# EAGLE design Slave-Nano (EAGLE 9.6.2)
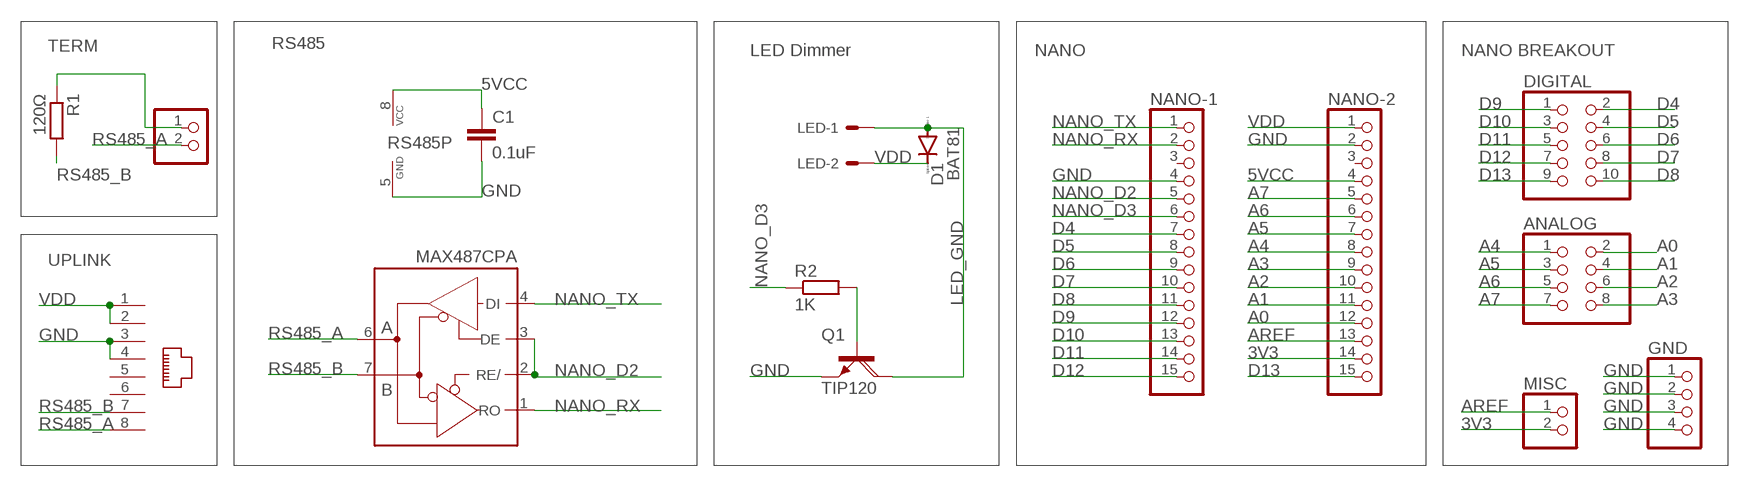
[diagram p0: schematic, sheet 1]

## Parts
ANALOG  PINHD-2X4  [2X04]
C1  0.1uF  C-EU025-025X050  [C025-025X050]
D1  BAT81  [DO34-7]
DIGITAL  PINHD-2X5  [2X05]
GND  PINHD-1X4  [1X04]
LED  KK-156-2  [KK-156-2]
MISC  PINHD-1X2  [1X02]
NANO-1  PINHD-1X15  [1X15]
NANO-2  PINHD-1X15  [1X15]
Q1  TIP120  [TO220AH]
R1  120Ω  R-EU_0204/7  [0204/7]
R2  1K  R-EU_0204/7  [0204/7]
RS485  MAX487CPA  [DIL08]
TERM  PINHD-1X2  [1X02]
UPLINK  RJ45-8P8C  [RJ45-8P8C]

## Nets
3V3: MISC.2 NANO-2.14
5VCC: C1.1 NANO-2.4 RS485.8(VCC)
A0: ANALOG.2 NANO-2.12
A1: ANALOG.4 NANO-2.11
A2: ANALOG.6 NANO-2.10
A3: ANALOG.8 NANO-2.9
A4: ANALOG.1 NANO-2.8
A5: ANALOG.3 NANO-2.7
A6: ANALOG.5 NANO-2.6
A7: ANALOG.7 NANO-2.5
AREF: MISC.1 NANO-2.13
D4: DIGITAL.2 NANO-1.7
D5: DIGITAL.4 NANO-1.8
D6: DIGITAL.6 NANO-1.9
D7: DIGITAL.8 NANO-1.10
D8: DIGITAL.10 NANO-1.11
D9: DIGITAL.1 NANO-1.12
D10: DIGITAL.3 NANO-1.13
D11: DIGITAL.5 NANO-1.14
D12: DIGITAL.7 NANO-1.15
D13: DIGITAL.9 NANO-2.15
GND: C1.2 GND.1 GND.2 GND.3 GND.4 NANO-1.4 NANO-2.2 Q1.E RS485.5(GND) UPLINK.3 UPLINK.4
LED_GND: D1.A LED.1 Q1.C
LED_PWM: Q1.B R2.2
NANO_D2: NANO-1.5 RS485.2(RE/) RS485.3(DE)
NANO_D3: NANO-1.6 R2.1
NANO_RX: NANO-1.2 RS485.1(RO)
NANO_TX: NANO-1.1 RS485.4(DI)
RS485_A: RS485.6(A) TERM.2 UPLINK.8
RS485_B: R1.2 RS485.7(B) UPLINK.7
TERM: R1.1 TERM.1
VDD: D1.C LED.2 NANO-2.1 UPLINK.1 UPLINK.2
Unconnected: NANO-1.3 NANO-2.3 UPLINK.5 UPLINK.6

## Notes on the sheet
- LED Dimmer | NANO | NANO BREAKOUT

## Library data of the parts
ANALOG = pinhead:PINHD-2X4: PIN HEADER
C1 = rcl:C-EU: CAPACITOR, European symbol; SPICEPREFIX: C
D1 = diode:BAT81: DIODE barrier diode
DIGITAL = pinhead:PINHD-2X5: PIN HEADER
GND = pinhead:PINHD-1X4: PIN HEADER
LED = con-molex:KK-156-2: KK 156 HEADER Source: http://www.molex.com/pdm_docs/sd/026604100_sd.pdf; MF: MOLEX; OC_FARNELL: unknown; OC_NEWARK: unknown
MISC TERM = pinhead:PINHD-1X2: PIN HEADER
NANO-1 NANO-2 = pinhead:PINHD-1X15: PIN HEADER
Q1 = transistor-power:TIP120: NPN DARLINGTON TRANSISTOR
R1 R2 = rcl:R-EU_: RESISTOR, European symbol; SPICEPREFIX: R
RS485 = A10 Library:MAX487CPA: RS485 TRANSEIVER; MPN: MAX487CPA; OC_FARNELL: unknown; OC_NEWARK: unknown
UPLINK = A10 Library:RJ45-8P8C: PCB RJ45 8P8C Femlae Jack/Socket Connector 180 degree vertical https://www.aliexpress.com/item/32918645271.html?spm=a2g0o.order_list.0.0.49471802RMJK7Q

## Net classes
0 default: width 0.406 mm, drill 0.254 mm, clearance 0.406 mm

## Board
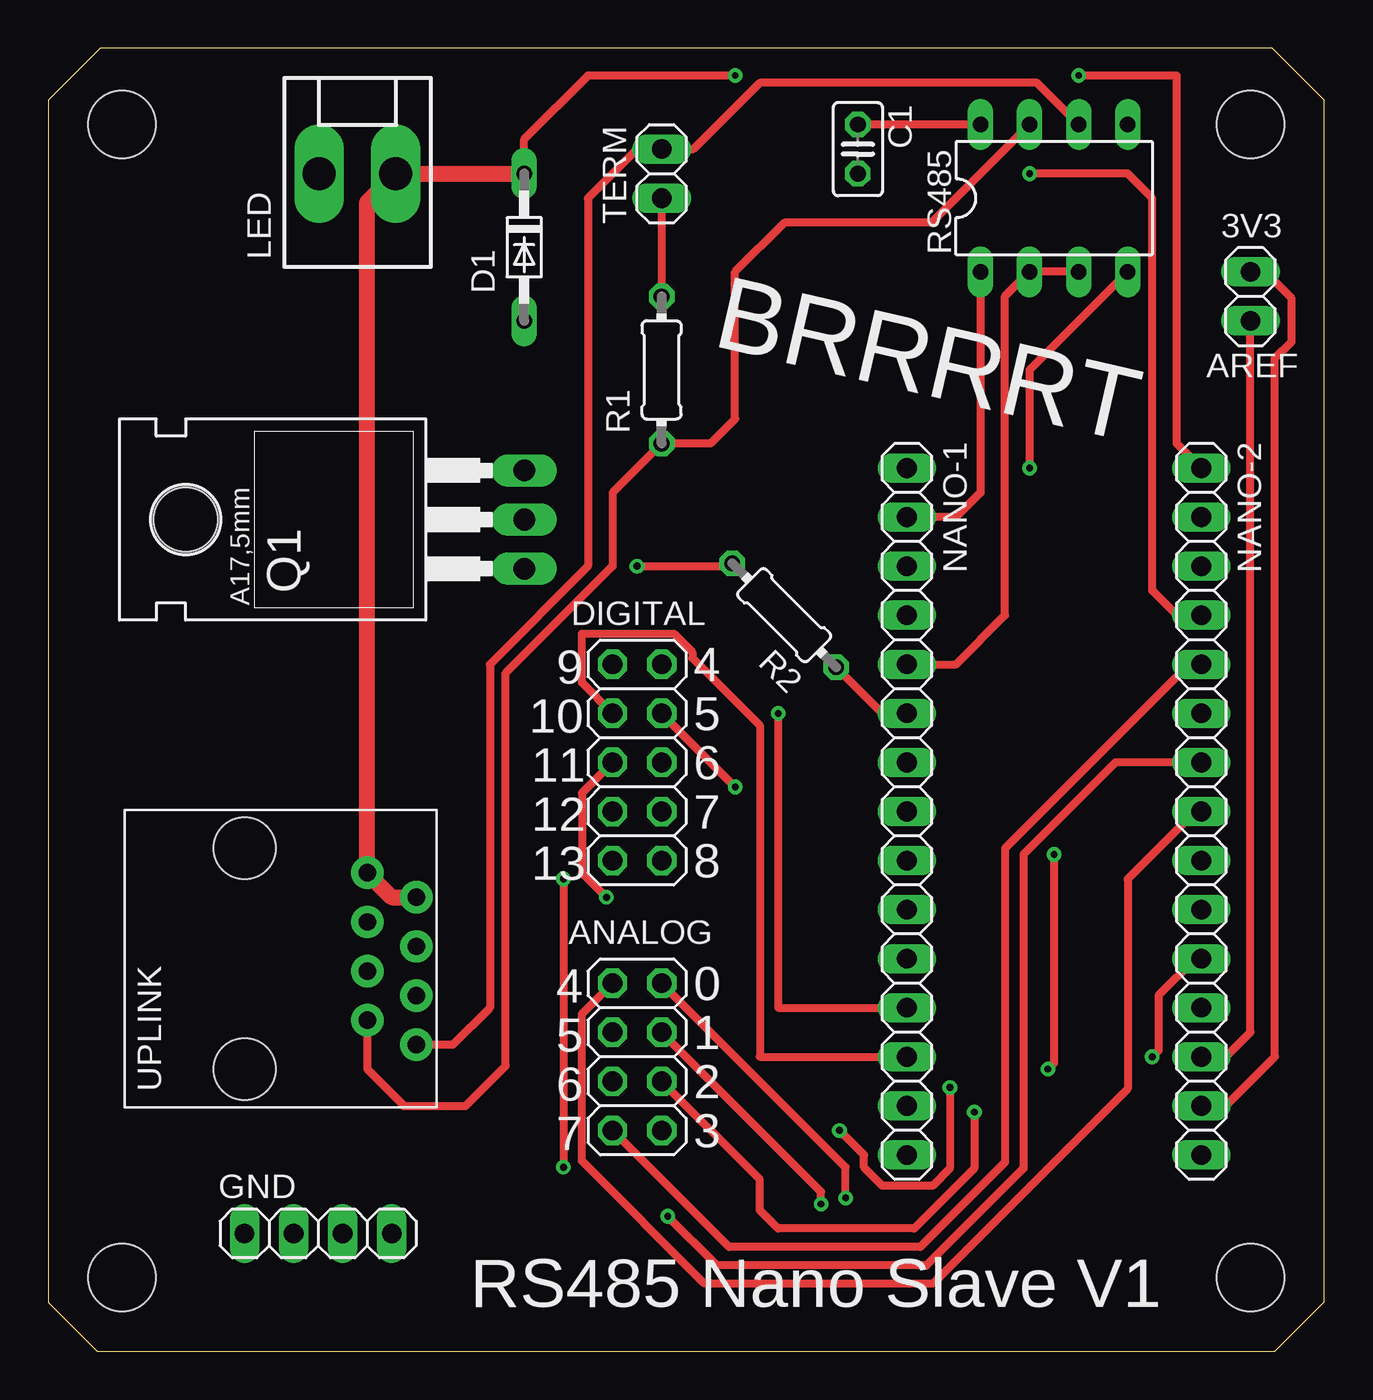
[diagram p1: board, top side]
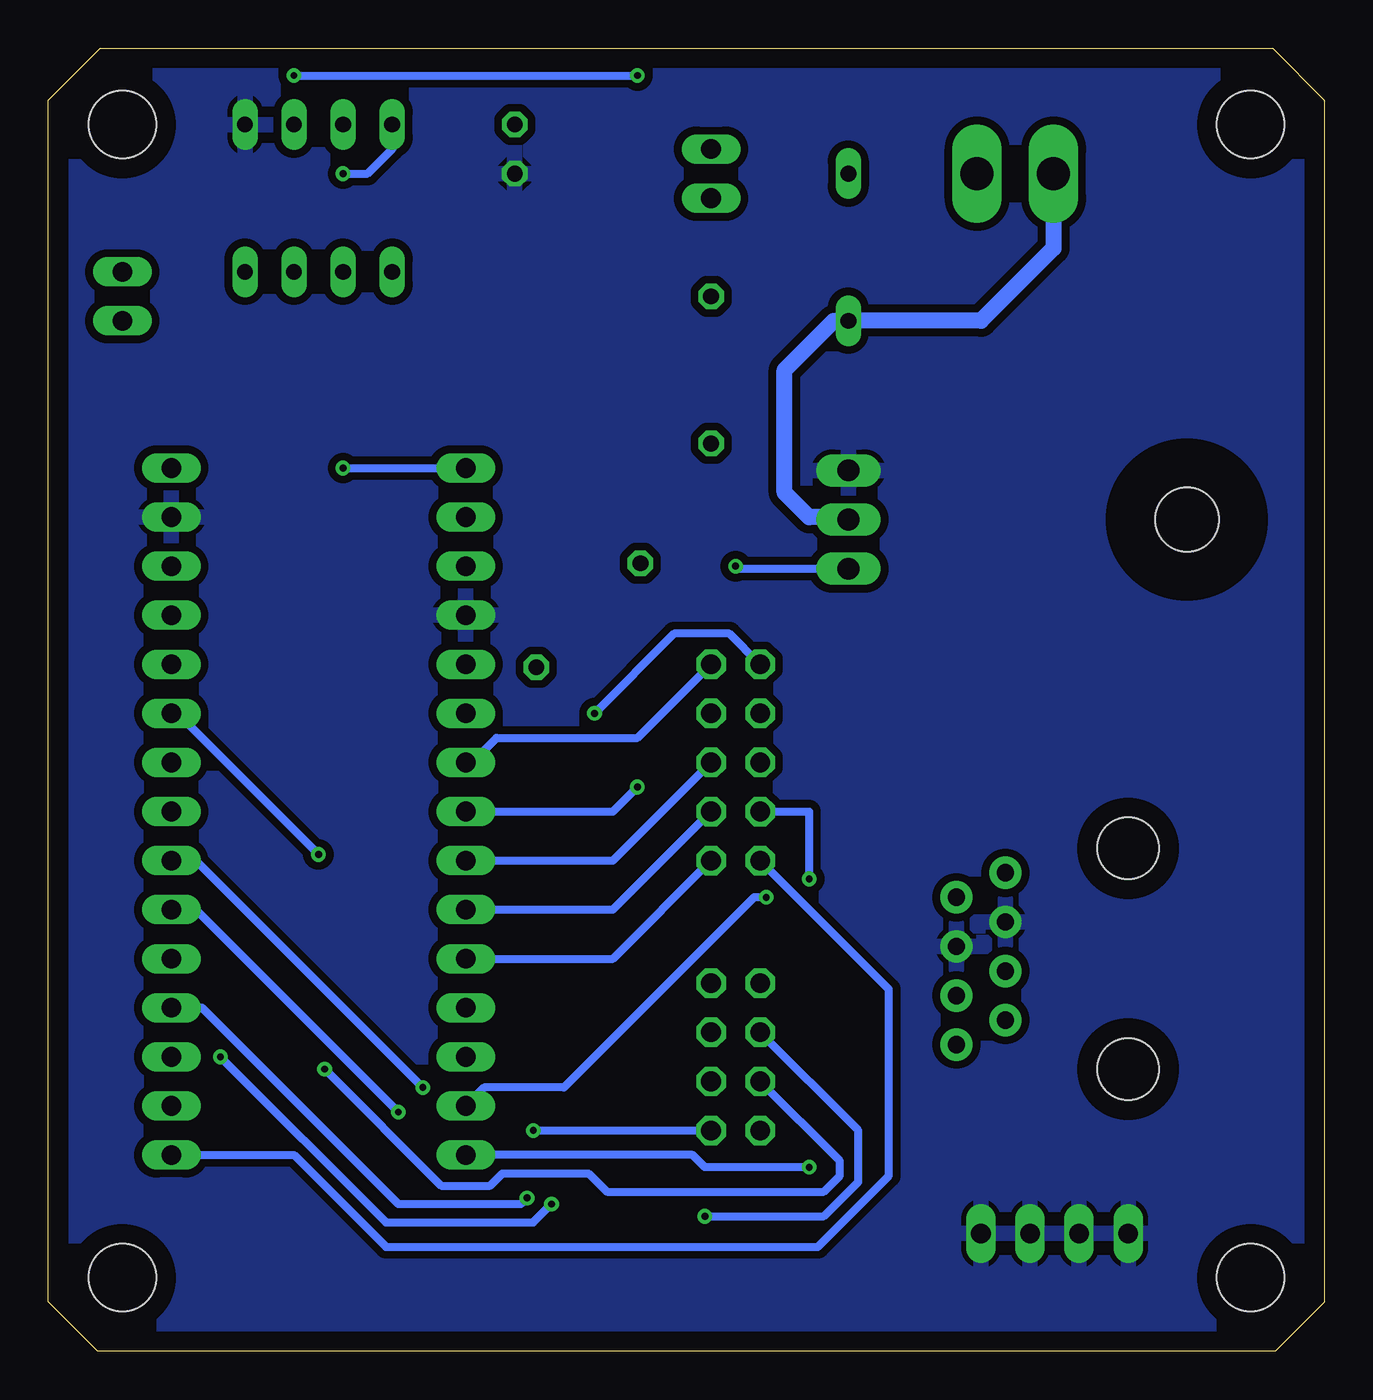
[diagram p2: board, bottom side, seen from below]

Size 66.06 x 67.45 mm. Coordinates in mm from the lower left corner, seen from the top.
Outline: 63.36,67.45 2.68,67.45 0,64.77 0,2.54 2.54,0 63.5,0 66.06,2.56 66.06,64.75 63.36,67.45
Copper layers (1*16): Top 0.035mm / dielectric 1.5mm / Bottom 0.035mm
Design rules "default": minimum track width 6mil, minimum drill 0.35mm, track to track 6mil, track to pad 6mil, pad to pad 6mil, via to via 6mil, smd to smd 6mil, copper to edge 40mil, drill to drill 6mil, minimum pad ring 10mil, minimum via ring 8mil, stop-mask expansion 4mil, vias tented up to drill 0mil, thermal gap 10mil
Holes 3.5 mm at 3.81,63.5 62.23,63.5 62.23,3.81 3.81,3.81

### Footprints (pad centres in the part's own frame; a part is rotated, then mirrored left to right if it is on the bottom)
2X04 = drill 1.016 octagon: 1 -3.81,-1.27; 2 -3.81,1.27; 3 -1.27,-1.27; 4 -1.27,1.27; 5 1.27,-1.27; 6 1.27,1.27; 7 3.81,-1.27; 8 3.81,1.27
C025-025X050 = drill 0.813 octagon: 1 -1.27,0; 2 1.27,0
DO34-7 = drill 0.813 long: A 3.81,0; C -3.81,0
2X05 = drill 1.016 octagon: 1 -5.08,-1.27; 2 -5.08,1.27; 3 -2.54,-1.27; 4 -2.54,1.27; 5 0,-1.27; 6 0,1.27; 7 2.54,-1.27; 8 2.54,1.27; 9 5.08,-1.27; 10 5.08,1.27
1X04 = drill 1.016 long: 1 -3.81,0; 2 -1.27,0; 3 1.27,0; 4 3.81,0
KK-156-2 = drill 1.7 pad 2.184 long: 1 -1.98,0; 2 1.98,0
1X02 = drill 1.016 long: 1 -1.27,0; 2 1.27,0
1X15 = drill 1.016 long: 1 -17.78,0; 2 -15.24,0; 3 -12.7,0; 4 -10.16,0; 5 -7.62,0; 6 -5.08,0; 7 -2.54,0; 8 0,0; 9 2.54,0; 10 5.08,0; 11 7.62,0; 12 10.16,0; 13 12.7,0; 14 15.24,0; 15 17.78,0
TO220AH = drill 1.118 long: B -2.54,-6.35; C 0,-6.35; E 2.54,-6.35 | hole 3.302: 0,11.176
0204/7 = drill 0.813 octagon: 1 -3.81,0; 2 3.81,0
DIL08 = drill 0.813 long: 1 -3.81,-3.81; 2 -1.27,-3.81; 3 1.27,-3.81; 4 3.81,-3.81; 5 3.81,3.81; 6 1.27,3.81; 7 -1.27,3.81; 8 -3.81,3.81
RJ45-8P8C = drill 0.9 pad 1.676: 1 4.445,-6.35; 2 3.175,-8.89; 3 1.905,-6.35; 4 0.635,-8.89; 5 -0.635,-6.35; 6 -1.905,-8.89; 7 -3.175,-6.35; 8 -4.445,-8.89 | hole 3.2: -5.715,0; 5.715,0

### Placement (x,y rotation side)
ANALOG  30.48,15.24 270 top
C1  41.91,62.23 270 top
D1  24.64,57.15 270 top
DIGITAL  30.48,30.48 270 top
GND  13.97,6.1 0 top
LED  16,60.96 0 top
MISC  62.23,54.61 90 top
NANO-1  44.45,27.94 270 top
NANO-2  59.69,27.94 270 top
Q1  18.29,43.05 90 top
R1  31.75,50.8 270 top
R2  38.1,38.1 135 top
RS485  52.07,59.69 0 top
TERM  31.75,60.96 90 top
UPLINK  10.16,20.32 90 top

### Tracks (layer width: path | path; a pad name or v marks a point on that pad's centre or on a via)
3V3
  Top 0.406: NANO-2.14 60.96,12.7 63.5,15.24 63.5,51.4 64.36,52.26 64.36,54.51 62.99,55.88 MISC.2
5VCC  (via drill 0.35)
  Top 0.406: RS485.8 C1.1 | NANO-2.4 58.42,38.1 57.15,39.37 57.15,59.69 55.88,60.96 v50.8,60.96
  Bottom 0.406: v50.8,60.96 49.53,60.96 48.26,62.23 RS485.8
A0  (via drill 0.35)
  Top 0.406: ANALOG.2 41.27,9.53 v41.27,7.94
  Bottom 0.406: v41.27,7.94 41.59,7.62 47.94,7.62 58.1,17.78 NANO-2.12
A1  (via drill 0.35)
  Top 0.406: ANALOG.4 40.01,8.26 v40.01,7.62 | v57.15,15.24 57.47,15.56 57.47,18.41 59.37,20.32 NANO-2.11
  Bottom 0.406: v40.01,7.62 40.96,6.67 48.58,6.67 v57.15,15.24
A2  (via drill 0.35)
  Top 0.406: ANALOG.6 36.83,8.89 36.83,7.3 37.78,6.35 44.83,6.35 47.94,9.46 v47.94,12.38
  Bottom 0.406: v47.94,12.38 58.42,22.86 NANO-2.10
A3  (via drill 0.35)
  Top 0.406: v40.96,11.43 42.23,10.16 42.23,9.53 43.18,8.57 45.78,8.57 46.67,9.46 v46.67,13.65
  Bottom 0.406: v40.96,11.43 ANALOG.8 | v46.67,13.65 58.42,25.4 NANO-2.9
A4
  Top 0.406: ANALOG.1 27.62,17.46 27.62,9.84 33.97,3.49 45.78,3.49 55.88,13.59 55.88,24.45 59.37,27.94 NANO-2.8
A5  (via drill 0.35)
  Top 0.406: v32.07,6.99 34.61,4.45 45.47,4.45 50.48,9.46 50.48,25.72 55.24,30.48 NANO-2.7
  Bottom 0.406: ANALOG.3 24.13,11.43 24.13,8.76 25.91,6.99 v32.07,6.99
A6  (via drill 0.35)
  Top 0.406: v51.75,14.61 52.07,14.92 v52.07,25.72
  Bottom 0.406: ANALOG.5 25.08,9.84 25.08,9.08 25.91,8.26 37.15,8.26 38.1,9.21 42.55,9.21 43.18,8.57 45.72,8.57 v51.75,14.61 | v52.07,25.72 59.37,33.02 NANO-2.6
A7
  Top 0.406: ANALOG.7 35.24,5.4 45.15,5.4 49.53,9.78 49.53,26.04 59.05,35.56 NANO-2.5
AREF
  Top 0.406: NANO-2.13 60.96,15.24 62.23,16.51 MISC.1
D4
  Bottom 0.406: DIGITAL.2 35.56,31.75 42.86,31.75 44.13,30.48 NANO-1.7
D5  (via drill 0.35)
  Top 0.406: v35.56,29.21 DIGITAL.4
  Bottom 0.406: v35.56,29.21 36.83,27.94 NANO-1.8
D6
  Bottom 0.406: DIGITAL.6 36.83,25.4 NANO-1.9
D7
  Bottom 0.406: DIGITAL.8 36.83,22.86 NANO-1.10
D8
  Bottom 0.406: DIGITAL.10 36.83,20.32 NANO-1.11
D9  (via drill 0.35)
  Top 0.406: NANO-1.12 37.78,17.78 v37.78,33.02
  Bottom 0.406: v37.78,33.02 33.66,37.15 30.8,37.15 DIGITAL.1
D10
  Top 0.406: NANO-1.13 36.83,15.24 36.83,32.38 33.34,35.88 33.34,36.2 32.38,37.15 27.62,37.15 27.62,34.61 DIGITAL.3
D11  (via drill 0.35)
  Top 0.406: v28.89,23.5 27.62,24.77 27.62,28.89 DIGITAL.5
  Bottom 0.406: NANO-1.14 43.5,13.65 39.37,13.65 29.53,23.5 v28.89,23.5
D12  (via drill 0.35)
  Top 0.406: v26.67,24.45 v26.67,9.53
  Bottom 0.406: NANO-1.15 32.7,10.16 32.07,9.53 v26.67,9.53 | v26.67,24.45 26.67,27.94 DIGITAL.7
D13
  Bottom 0.406: DIGITAL.9 22.54,18.73 22.54,9.08 26.23,5.4 48.58,5.4 53.34,10.16 NANO-2.15
GND
  pour Bottom: -1.27,68.58 64.77,68.58 64.77,-1.27 -1.27,-1.27
LED_GND
  Bottom 0.838: LED.1 14.02,57.1 17.78,53.34 D1.A 25.4,53.34 27.94,50.8 27.94,44.45 26.67,43.18 24.77,43.18 Q1.C
LED_PWM  (via drill 0.35)
  Top 0.406: R2.2 35.38,40.64 v30.48,40.64
  Bottom 0.406: v30.48,40.64 30.35,40.51 Q1.B
NANO_D2
  Top 0.406: NANO-1.5 46.99,35.56 49.53,38.1 49.53,54.61 RS485.2 RS485.3
NANO_D3
  Top 0.406: NANO-1.6 43.18,33.02 R2.1
NANO_RX
  Top 0.406: NANO-1.2 46.99,43.18 48.26,44.45 RS485.1
NANO_TX  (via drill 0.35)
  Top 0.406: RS485.4 50.8,50.8 v50.8,45.72
  Bottom 0.406: v50.8,45.72 NANO-1.1
RS485_A
  Top 0.406: RS485.6 51.18,65.66 36.83,65.66 33.4,62.23 TERM.2 30.48,62.23 27.94,59.69 27.94,40.64 22.86,35.56 22.86,17.78 20.95,15.88 UPLINK.8
RS485_B
  Top 0.406: RS485.7 45.72,58.42 38.1,58.42 35.56,55.88 35.56,48.26 34.29,46.99 R1.2 29.21,44.45 29.21,40.64 23.67,35.1 23.67,14.78 21.59,12.7 18.41,12.7 16.51,14.61 UPLINK.7
TERM
  Top 0.406: TERM.1 R1.1
VDD  (via drill 0.35)
  Top 0.406: NANO-2.1 58.42,46.99 58.42,66.04 v53.34,66.04 | v35.56,66.04 27.94,66.04 24.64,62.74 D1.C
  Top 0.838: D1.C LED.2 16.51,59.49 UPLINK.1 17.78,23.5 UPLINK.2
  Bottom 0.406: v53.34,66.04 v35.56,66.04

### Text on the board
tNames: 3V3 | BRRRRT | AREF | 9 | 4 | 10 | 5 | 6 | 11 | 12 | 7 | 8 | 13 | 4 | 0 | 1 | 5 | 6 | 2 | 3 | 7 | RS485 Nano Slave V1